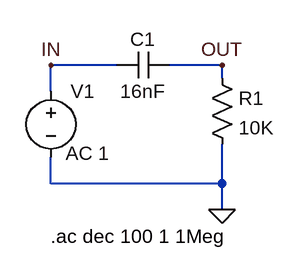
[diagram p0: schematic schematics.asc]
schematics.asc, the LTspice schematic file:
Version 4.1
SHEET 1 880 680
WIRE 160 80 80 80
WIRE 288 80 224 80
WIRE 288 96 288 80
WIRE 80 112 80 80
WIRE 80 224 80 192
WIRE 288 224 288 176
WIRE 288 224 80 224
WIRE 288 256 288 224
FLAG 288 256 0
FLAG 288 80 OUT
FLAG 80 80 IN
SYMBOL cap 224 64 R90
WINDOW 0 0 32 VBottom 2
WINDOW 3 32 32 VTop 2
SYMATTR InstName C1
SYMATTR Value 16nF
SYMBOL res 272 80 R0
SYMATTR InstName R1
SYMATTR Value 10K
SYMBOL voltage 80 96 R0
WINDOW 3 18 119 Left 2
WINDOW 123 18 91 Left 2
WINDOW 39 0 0 Left 0
SYMATTR InstName V1
SYMATTR Value ""
SYMATTR Value2 AC 1
TEXT 80 288 Left 2 !.ac dec 100 1 1Meg

The netlist it stands for:
* schematics.asc
C1 OUT IN 16nF
R1 OUT 0 10K
V1 IN 0 AC 1
.ac dec 100 1 1Meg
.backanno
.end